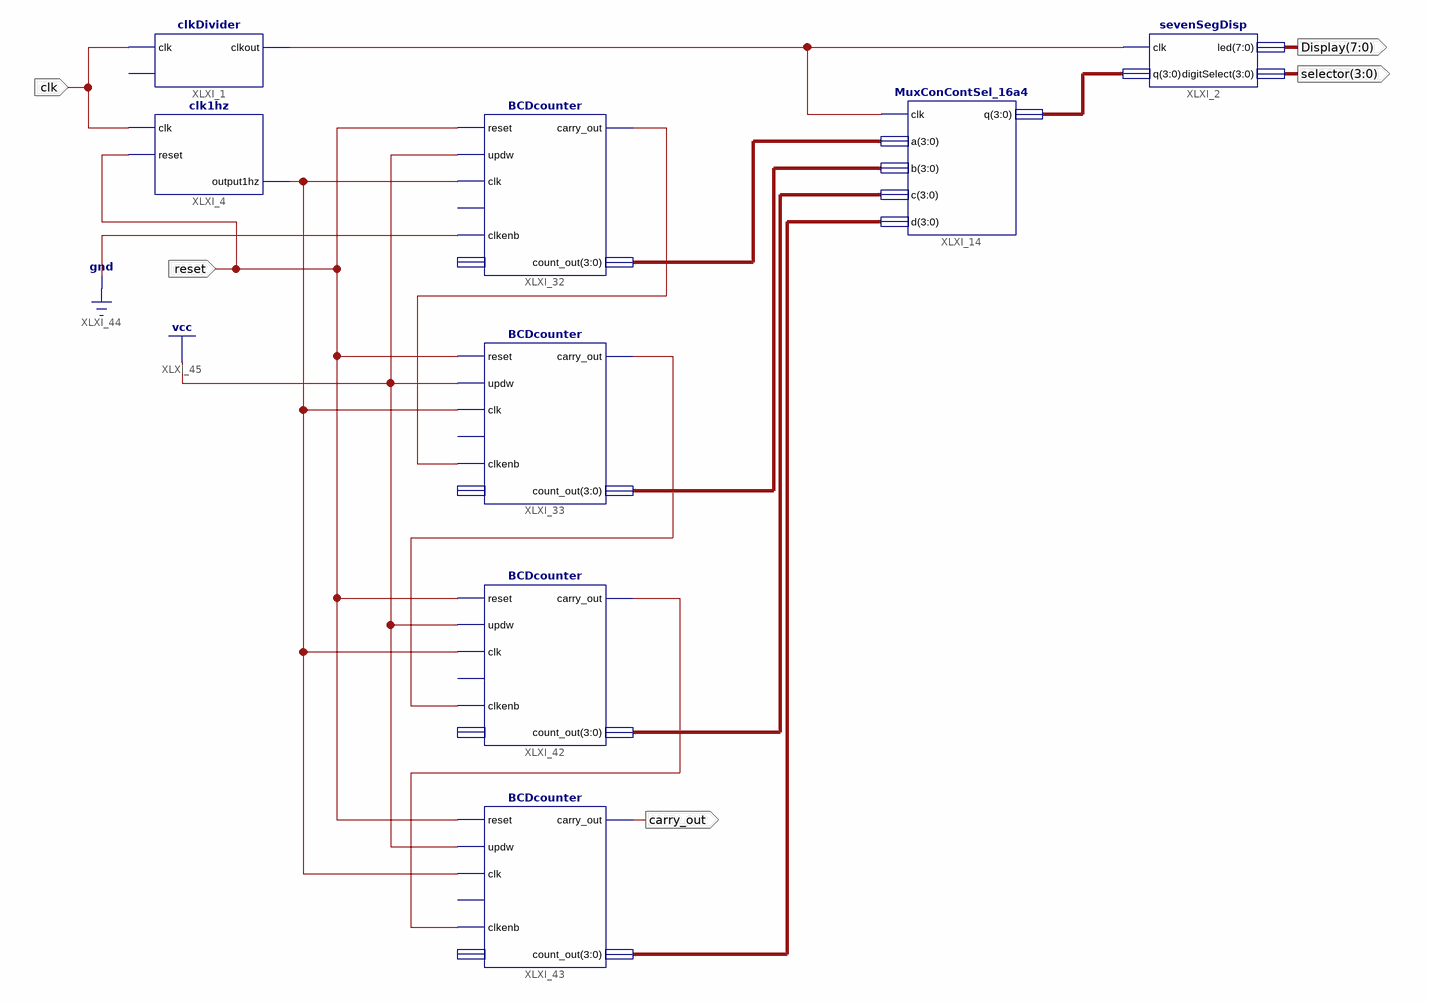
[diagram p0: schematic sheet 1]
// Xilinx ISE schematic top.sch (spartan3e) as structural Verilog: 8 symbols, 5 ports
module top (
  input  clk,
  input  reset,
  output [7:0] Display,
  output [3:0] selector,
  output carry_out
);

  wire XLXN_86, XLXN_164, XLXN_173, XLXN_175, XLXN_176;
  wire [3:0] led1, XLXN_87, XLXN_144, XLXN_177, XLXN_178;

  sevenSegDisp XLXI_2 (.clk(XLXN_86), .q(XLXN_87), .led(Display), .digitSelect(selector));
  MuxConContSel_16a4 XLXI_14 (.clk(XLXN_86), .a(led1), .b(XLXN_144), .c(XLXN_177), .d(XLXN_178), .q(XLXN_87));
  BCDcounter XLXI_32 (
    .reset(reset), .updw(1'b1), .clk(XLXN_164), .clkenb(1'b0), .carry_out(XLXN_173), .count_out(led1));  // open: loadenb, load_in
  BCDcounter XLXI_33 (
    .reset(reset), .updw(1'b1), .clk(XLXN_164), .clkenb(XLXN_173), .carry_out(XLXN_175), .count_out(XLXN_144));  // open: loadenb, load_in
  clkDivider XLXI_1 (.clk(clk), .clkout(XLXN_86));  // open: reset
  clk1hz XLXI_4 (.clk(clk), .reset(reset), .output1hz(XLXN_164));
  BCDcounter XLXI_42 (
    .reset(reset), .updw(1'b1), .clk(XLXN_164), .clkenb(XLXN_175), .carry_out(XLXN_176), .count_out(XLXN_177));  // open: loadenb, load_in
  BCDcounter XLXI_43 (
    .reset(reset), .updw(1'b1), .clk(XLXN_164), .clkenb(XLXN_176), .carry_out(carry_out), .count_out(XLXN_178));  // open: loadenb, load_in
endmodule
